# EasyEDA Pro project LR2-controller.eprj

# Schematic Schematic1
Board Name: Board1; Create Date: 2024-05-18; Page Name: P1; Project Name: LR2-controller; Schematic Name: Schematic1; Update Date: 2026-07-11; Company: EasyEDA.com; Drawn: EasyEDA; Page Size: A4; Part Number: JLCPCB-002; Reviewed: EasyEDA; Version: V0.1
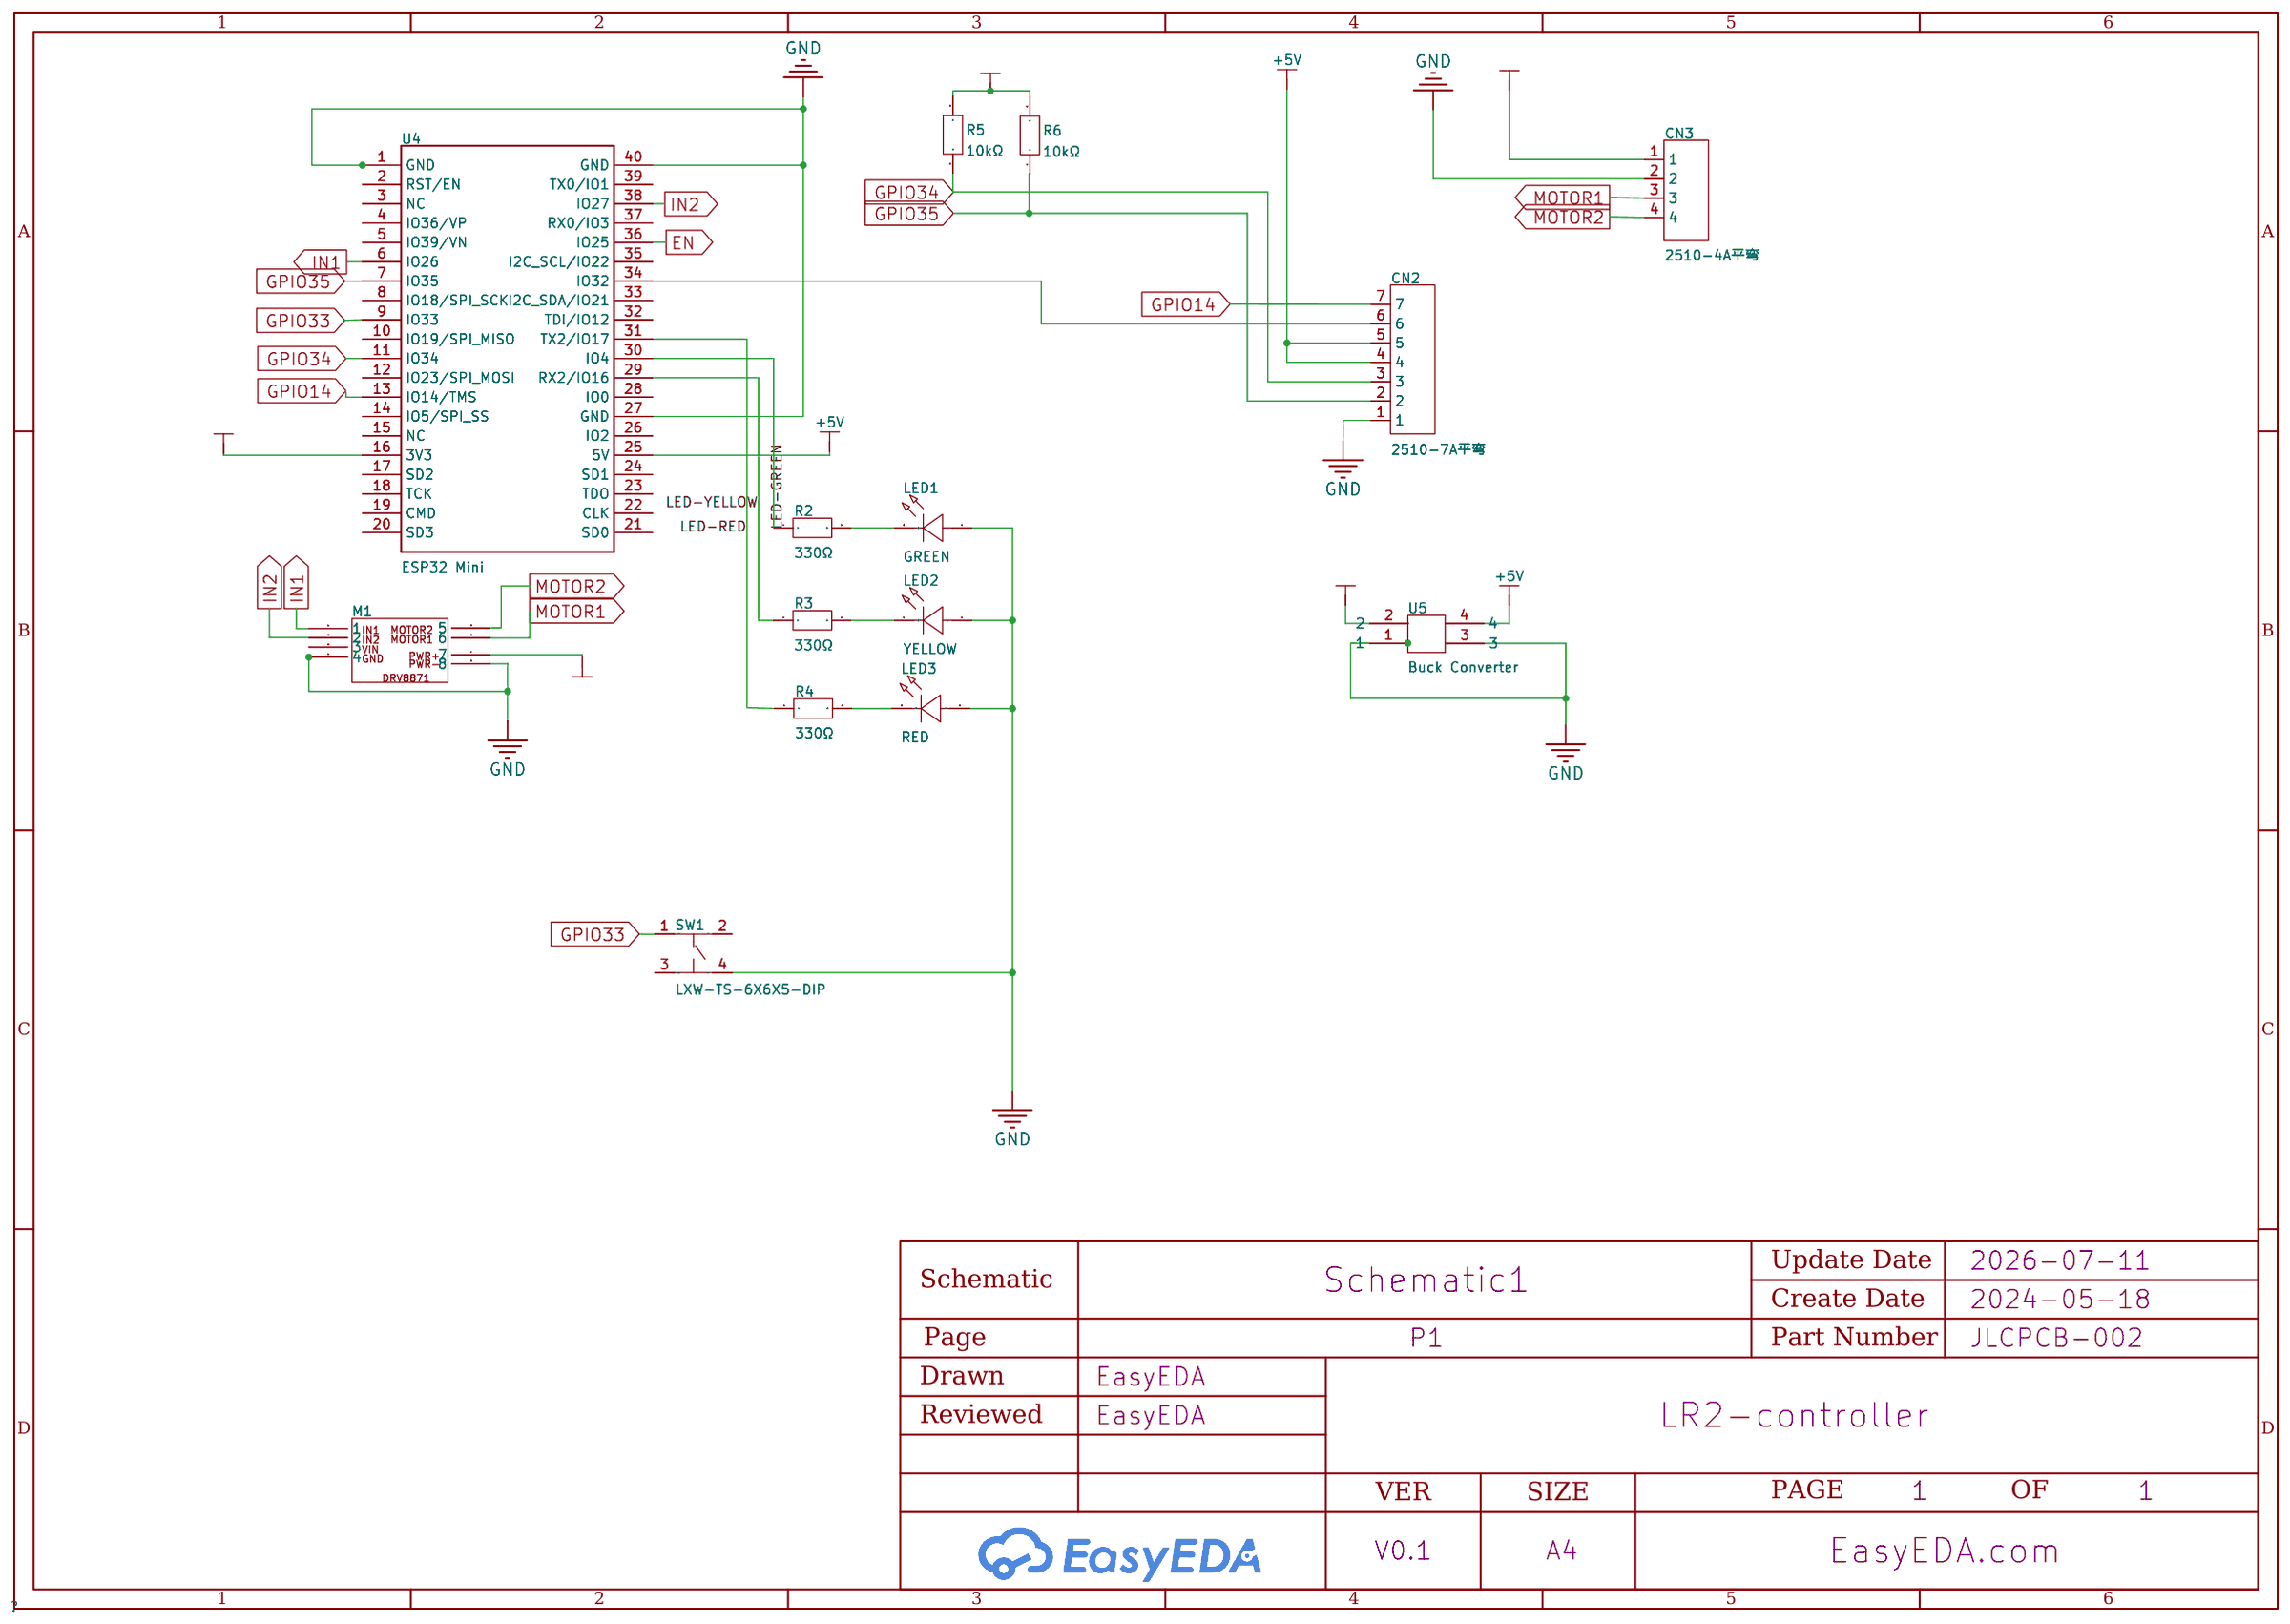
[diagram p0: schematic sheet]

## Parts
CN2  2510-7A平弯  [CONN-TH_7P-P2.54_KF2510-7AW]
CN3  2510-4A平弯  [CONN-TH_4P-P2.54_KF2510-4AGW]
LED1  GREEN  [LED-TH_BD5.8-P2.28-FD]
LED2  YELLOW  [LED-TH_BD5.8-P2.28-FD]
LED3  RED  [LED-TH_BD5.8-P2.28-FD]
M1  -  [Adafruit DRV8871]
R2  330Ω  [RES-TH_BD2.7-L6.2-P10.20-D0.4]
R3  330Ω  [RES-TH_BD2.7-L6.2-P10.20-D0.4]
R4  330Ω  [RES-TH_BD2.7-L6.2-P10.20-D0.4]
R5  10kΩ  [RES-TH_BD2.7-L6.2-P10.20-D0.4]
R6  10kΩ  [RES-TH_BD2.7-L6.2-P10.20-D0.4]
SW1  LXW-TS-6X6X5-DIP  [SW-TH_4P-L6.0-W6.0-P4.50-LS6.5]
U4  ESP32 Mini  [ESP32 TTGO MINI32]
U5  Buck Converter  [Buck Converter]

## Library data of the parts
CN2 = 2510-7A平弯: Pins Structure:1x7P Pitch:2.54mm Mounting Type:Right Angle Reference Series:KK 254(MX2510) Number of Pins:7P Number of Rows:1 Number of PINs Per Row:7 Row Spacing:- Current Rating:2.5A Contact Material:Phosphor Bronze Contact Plating:Tin Operating Tempera; LCSC Part Name: 1x7P 间距:2.54mm 弯插 系列:KK 254(MX2510); Supplier Part: C70896; Manufacturer: BOOMELE(博穆精密); Supplier Footprint: 弯插,P=2.54mm; JLCPCB Part Class: Extended Part; Datasheet: https://item.szlcsc.com/datasheet/2510-7A%25E5%25B9%25B3%25E5%25BC%25AF/71995.html; Supplier: LCSC; Pins Structure: 1x7P; Pitch: 2.54mm; Mounting Type: Right Angle; Reference Series: KK 254(MX2510); Number of Pins: 7P; Number of Rows: 1; Number of PINs Per Row: 7; Current Rating: 2.5A; Contact Material: Phosphor Bronze; Contact Plating: Tin; Operating Temperature: -25℃~+85℃; Voltage Rating: 250V; Color: White; Z-Height of the Board: 5.7mm; Y-Width of Bottom Edge on Board: 3.2mm
CN3 = 2510-4A平弯: LCSC Part Name: 1x4P 间距:2.54mm 弯插 系列:KK 254(MX2510); Supplier Part: C31753; Manufacturer: BOOMELE(博穆精密); Supplier Footprint: 弯插,P=2.54mm; JLCPCB Part Class: Extended Part; Datasheet: https://item.szlcsc.com/datasheet/2510-4A%25E5%25B9%25B3%25E5%25BC%25AF/32712.html; Supplier: LCSC; Pins Structure: 1x4P; Pitch: 2.54mm; Mounting Type: Right Angle; Reference Series: KK 254(MX2510); Number of Pins: 4P; Number of Rows: 1; Number of PINs Per Row: 4; Current Rating: 2.5A; Contact Material: Phosphor Bronze; Contact Plating: Tin; Operating Temperature: -25℃~+85℃; Voltage Rating: 250V; Color: White; Z-Height of the Board: 5.7mm; Y-Width of Bottom Edge on Board: 3.2mm
LED1-LED3 = 5A2K-10: LCSC Part Name: 5mm黑色红外光敏接收管; Supplier Part: C52034730; Manufacturer: Guiguang light(桂光光电); Supplier Footprint: 插件,D=5mm; JLCPCB Part Class: Extended Part; Datasheet: https://item.szlcsc.com/datasheet/5A2K-10/54791048.html; Supplier: LCSC; Voltage - DC Reverse(Vr): 30V; Peak Wavelength: 940nm; Spectral Range: 760nm~1100nm; Dark Current: 100nA; Operating Temperature: -40℃~+85℃
M1 = Adafruit DRV8871: Adafruit DRV8871 DC Motor Driver Breakout Board - 3.6A Max
R2-R4 = CR1/4W-330Ω±5%-OT52: LCSC Part Name: 碳膜电阻 330Ω ±5% 250mW 0.4镀锡铜脚 编带内跨距52MM; Supplier Part: C2894590; Manufacturer: VO(翔胜); Supplier Footprint: 插件,D2.7xL6.2mm; JLCPCB Part Class: Extended Part; Datasheet: https://item.szlcsc.com/datasheet/CR1%252F4W-330%25CE%25A9%25C2%25B15%2525-OT52/3130107.html; Supplier: LCSC; Type: Carbon Film Resistor; Tolerance: ±5%; Voltage-Supply(Max): 250V; Power(Watts): 250mW; Temperature Coefficient: ±350ppm/℃; Operating Temperature: -55℃~+155℃
R5 R6 = CR1/4W-10K±5%-OT52: Type:Carbon Resister Resistance: Tolerance:±5% Tolerance:±5% Voltage-Supply(Max):250V Power(Watts):250mW Temperature Coefficient:±350ppm/℃ Temperature Coefficient:±350ppm/℃ Operating Temperature:-55℃~+155℃ Operating Temperature:-55℃~+155℃; LCSC Part Name: 碳膜电阻 10kΩ ±5% 250mW 0.4镀锡铜脚 编带内跨距52MM; Supplier Part: C2894557; Manufacturer: VO(翔胜); Supplier Footprint: 插件,D2.7xL6.2mm; JLCPCB Part Class: Extended Part; Datasheet: https://atta.szlcsc.com/upload/public/pdf/source/20210803/C2857407_45FF53FE186CAB545115AD37303966CD.pdf; Supplier: LCSC; Type: Carbon Resister; Tolerance: ±5%; Voltage-Supply(Max): 250V; Power(Watts): 250mW; Temperature Coefficient: ±350ppm/℃; Operating Temperature: -55℃~+155℃
SW1 = LXW-TS-6X6X5-DIP: LCSC Part Name: 6*6*5mm 直插 轻触开关; Supplier Part: C53447028; Manufacturer: LXWCONN(连兴旺电子); Supplier Footprint: 插件-4P,6x6mm; JLCPCB Part Class: Extended Part; Datasheet: https://item.szlcsc.com/datasheet/LXW-TS-6X6X5-DIP/56599287.html; Supplier: LCSC
U4 = ESP32 Mini
U5 = Buck Converter

## Nets
+3.3V: R5.2 R6.2 U4.16(3V3)
+5V: CN2.4 CN2.5 U4.25(5V) U5.4
+12V: CN3.1 M1.7 U5.2
GND: CN2.1 CN3.2 LED1.1(A) LED2.1(A) LED3.1(A) M1.4 M1.8 SW1.4 U4.1(GND) U4.27(GND) U4.40(GND) U5.1 U5.3
GPIO14: CN2.7 U4.13(IO14/TMS)
GPIO33: SW1.1 U4.9(IO33)
GPIO34: CN2.3 R5.1
GPIO35: CN2.2 R6.1
IN1: M1.1 U4.6(IO26)
IN2: M1.2 U4.38(IO27)
LED-GREEN: R2.1 U4.30(IO4)
LED-RED: R4.1 U4.31(TX2/IO17)
LED-YELLOW: U4.29(RX2/IO16)
MOTOR1: CN3.3 M1.6
MOTOR2: CN3.4 M1.5
$1N1818: LED1.2(C) R2.2
$1N1822: LED2.2(C) R3.2
$1N1837: LED3.2(C) R4.2
$1N1926: CN2.6 U4.34(IO32)

Not connected (* = marked no-connect by the designer): M1 3; R3 1; SW1 2 3; U4 2(RST/EN) 3(NC) 4(IO36/VP) 5(IO39/VN) 7(IO35) 8(IO18/SPI SCK) 10(IO19/SPI MISO) 11(IO34) 12(IO23/SPI MOSI) 14(IO5/SPI SS) 15(NC) 17(SD2) 18(TCK) 19(CMD) 20(SD3) 21(SD0) 22(CLK) 23(TDO) 24(SD1) 26(IO2) 28(IO0) 32(TDI/IO12) 33(I2C SDA/IO21) 35(I2C SCL/IO22) 36(IO25) 37(RX0/IO3) 39(TX0/IO1)

# Schematic Schematicv2
Board Name: Boardv2; Create Date: 2026-08-23; Page Name: P1; Project Name: LR2-controller; Schematic Name: Schematicv2; Update Date: 2026-08-23; Company: EasyEDA.com; Drawn: EasyEDA; Page Size: A4; Part Number: JLCPCB-002; Reviewed: EasyEDA; Version: V0.1
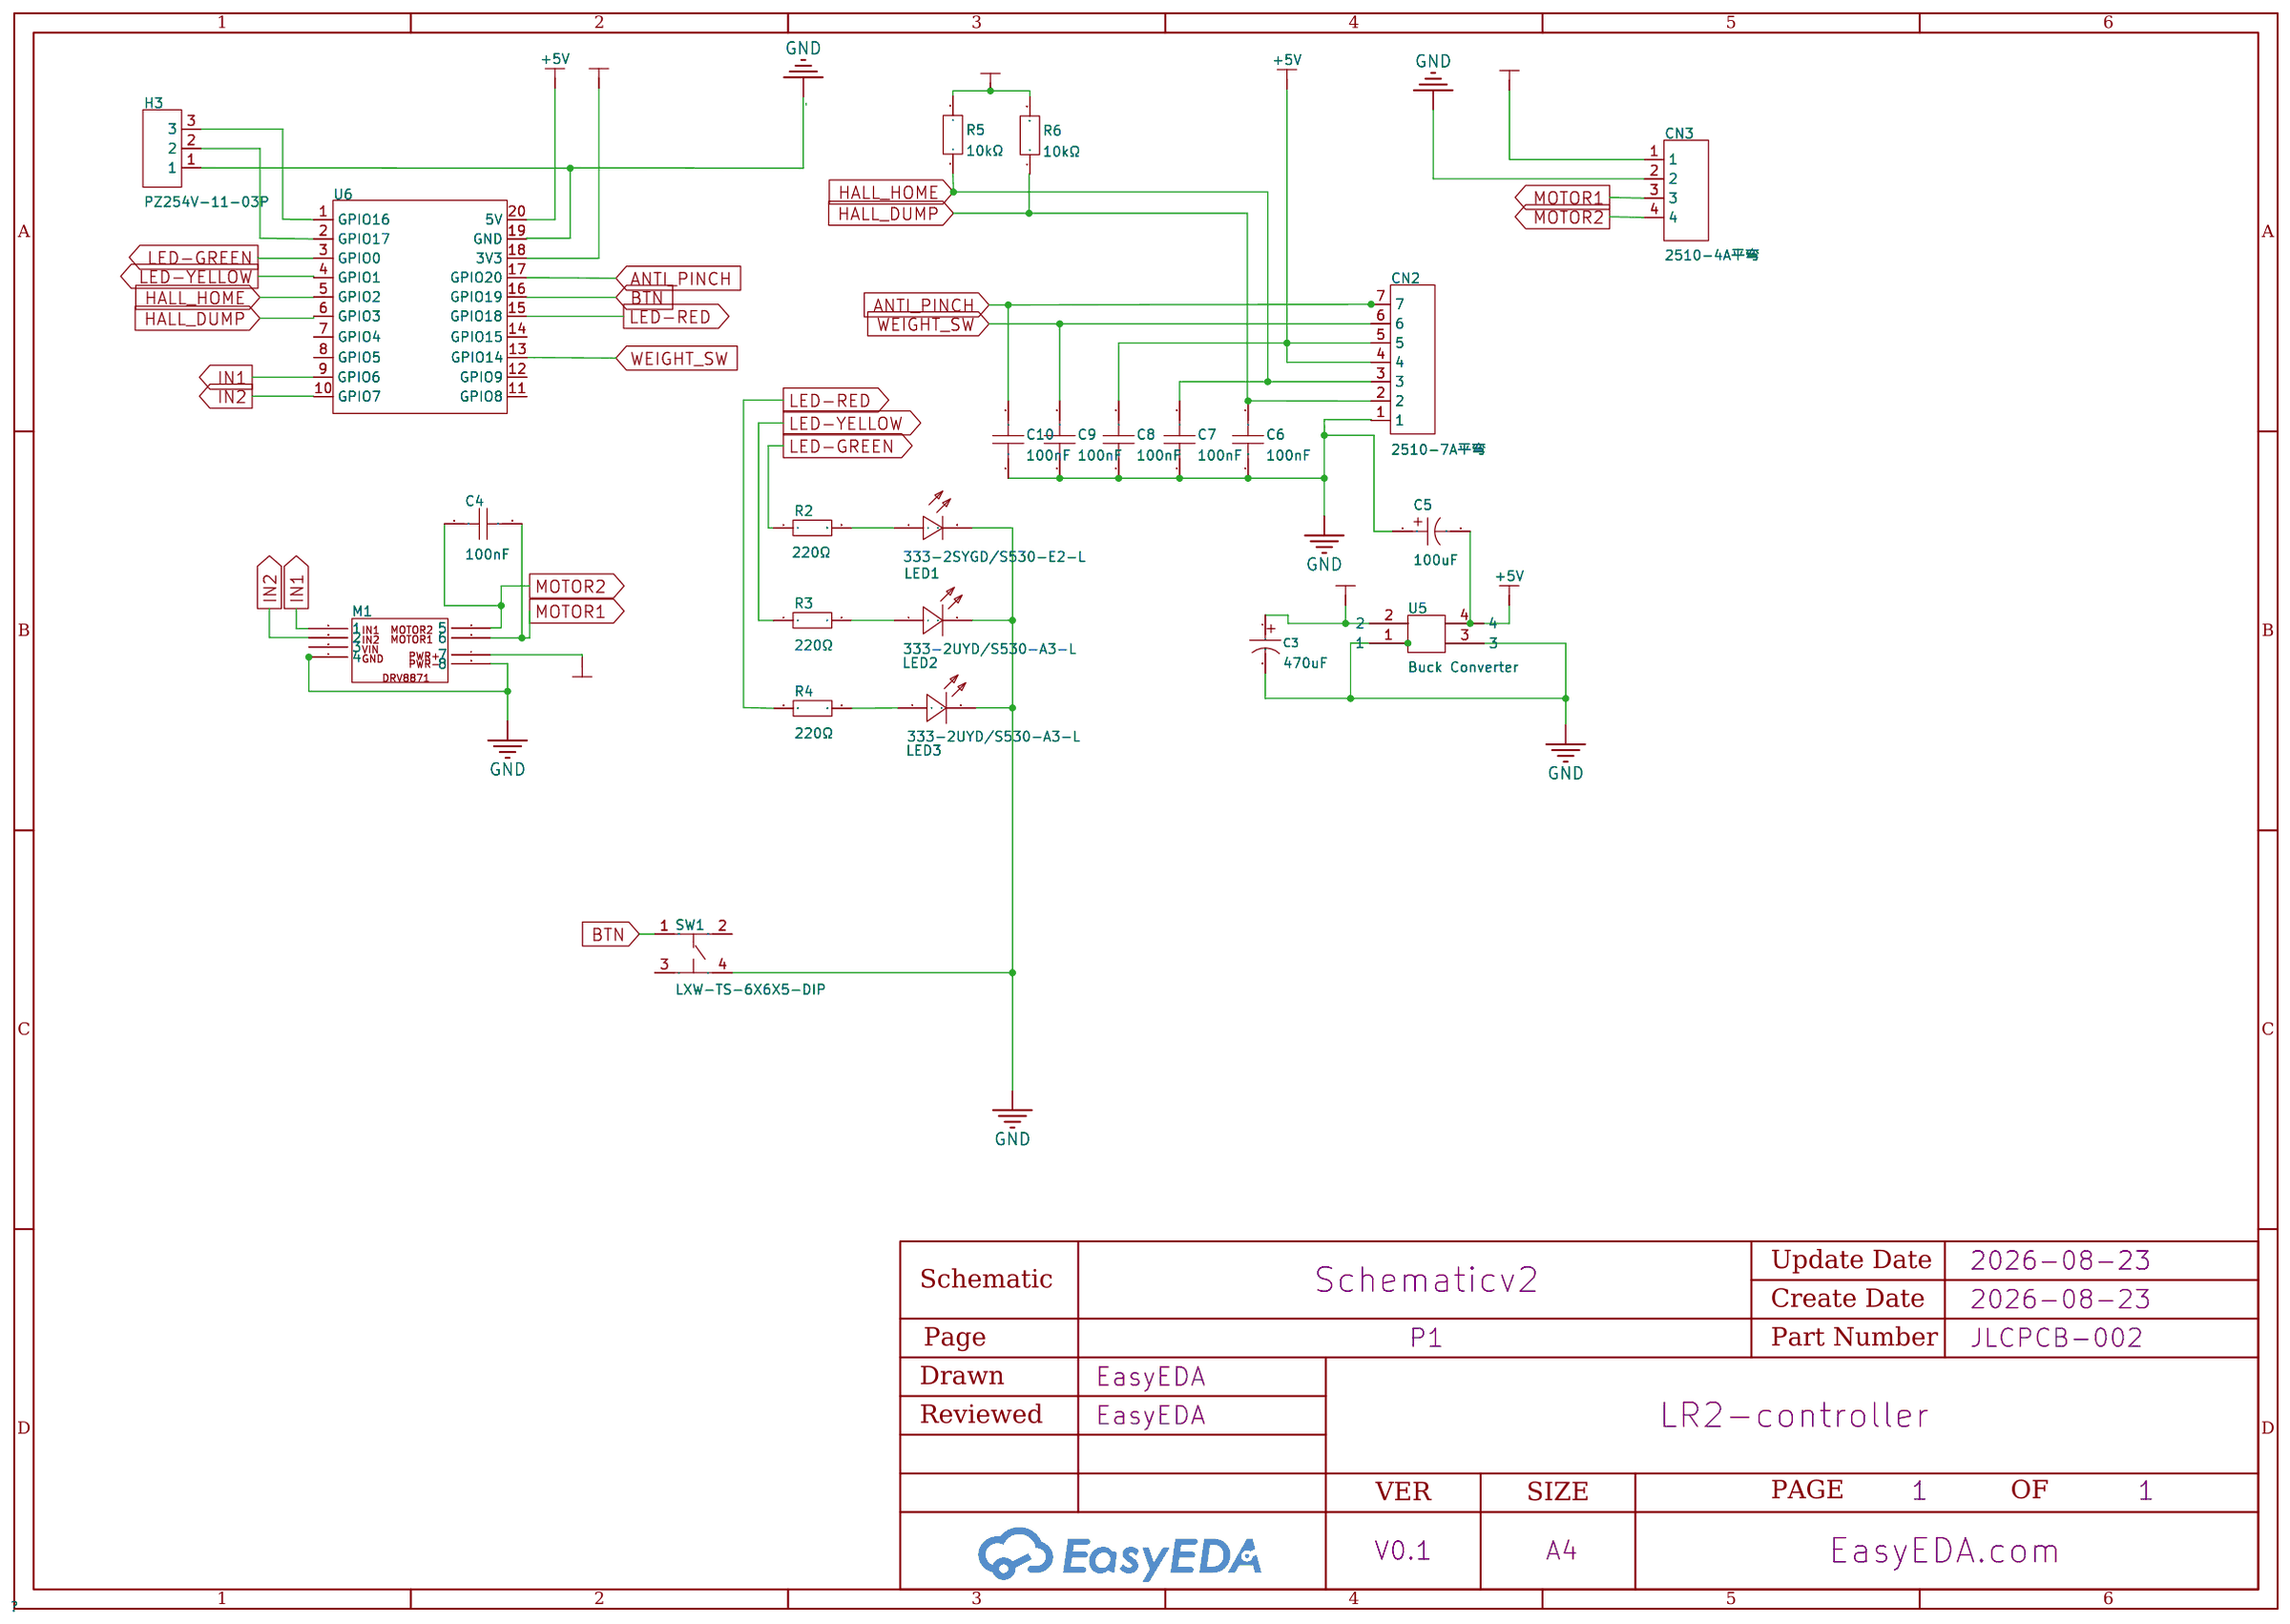
[diagram p1: schematic sheet]

## Parts
C3  470uF  [CAP-TH_BD10.0-P5.00-D1.0-FD]
C4  100nF  [CAP-TH_L4.5-W3.5-P5.08-D0.5]
C5  100uF  [CAP-TH_BD5.0-P2.00-D0.5-FD-1]
C6  100nF  [CAP-TH_L4.5-W3.5-P5.08-D0.5]
C7  100nF  [CAP-TH_L4.5-W3.5-P5.08-D0.5]
C8  100nF  [CAP-TH_L4.5-W3.5-P5.08-D0.5]
C9  100nF  [CAP-TH_L4.5-W3.5-P5.08-D0.5]
C10  100nF  [CAP-TH_L4.5-W3.5-P5.08-D0.5]
CN2  2510-7A平弯  [CONN-TH_7P-P2.54_KF2510-7AW]
CN3  2510-4A平弯  [CONN-TH_4P-P2.54_KF2510-4AGW]
H3  PZ254V-11-03P  [HDR-TH_3P-P2.54-V-M_PZ254V-11-03P]
LED1  333-2SYGD/S530-E2-L  [LED-TH_BD5.0-P2.54-FD]
LED2  333-2UYD/S530-A3-L  [LED-TH_BD5.0-P2.54-FD]
LED3  333-2UYD/S530-A3-L  [LED-TH_BD5.0-P2.54-FD]
M1  -  [Adafruit DRV8871]
R2  220Ω  [RES-TH_BD2.3-L6.5-P10.50-D0.5]
R3  220Ω  [RES-TH_BD2.3-L6.5-P10.50-D0.5]
R4  220Ω  [RES-TH_BD2.3-L6.5-P10.50-D0.5]
R5  10kΩ  [RES-TH_BD2.7-L6.2-P10.20-D0.4]
R6  10kΩ  [RES-TH_BD2.7-L6.2-P10.20-D0.4]
SW1  LXW-TS-6X6X5-DIP  [SW-TH_4P-L6.0-W6.0-P4.50-LS6.5]
U5  Buck Converter  [Buck Converter]
U6  ESP32-C6 SuperMini  [COMM-TH_ESP32-C6-SUPERMINI]

## Library data of the parts
C3 = 25WXA470MEFC10X9: LCSC Part Name: 470uF ±20% 25V; Supplier Part: C338182; Manufacturer: Rubycon(红宝石); Supplier Footprint: 插件,D10xL9mm; JLCPCB Part Class: Extended Part; Datasheet: https://item.szlcsc.com/datasheet/25WXA470MEFC10X9/315979.html; Supplier: LCSC; Tolerance: ±20%; Voltage Rating: 25V; Ripple Current: 370mA@120Hz; Pin Spacing: 5mm; Diameter: 10mm; Height - Seated (Max): 9mm; Lifetime: 2000hrs@105℃; Operating Temperature: -25℃~+125℃
C4 C6-C10 = CT4-0805-2X1-50V-0.1uF-K-Y: LCSC Part Name: 100nF ±10% 50V; Supplier Part: C41361550; Manufacturer: TORCH(火炬); Supplier Footprint: 插件,P=5.08mm; Datasheet: https://item.szlcsc.com/datasheet/CT4-0805-2X1-50V-0.1uF-K-Y/43105893.html; Supplier: LCSC; Tolerance: ±10%; Voltage Rating: 50V; Pin Spacing: 5.08mm
C5 = 16V100uF CD288: LCSC Part Name: 100uF ±20% 16V; Supplier Part: C2960195; Manufacturer: HRK(鸿瑞凯电子); Supplier Footprint: 插件,D5xL7mm; JLCPCB Part Class: Extended Part; Supplier: LCSC; Tolerance: ±20%; Voltage Rating: 16V; Pin Spacing: 2mm; Diameter: 5mm; Height - Seated (Max): 7mm; Operating Temperature: -40℃~+105℃
CN2 = 2510-7A平弯: Pins Structure:1x7P Pitch:2.54mm Mounting Type:Right Angle Reference Series:KK 254(MX2510) Number of Pins:7P Number of Rows:1 Number of PINs Per Row:7 Row Spacing:- Current Rating:2.5A Contact Material:Phosphor Bronze Contact Plating:Tin Operating Tempera; LCSC Part Name: 1x7P 间距:2.54mm 弯插 系列:KK 254(MX2510); Supplier Part: C70896; Manufacturer: BOOMELE(博穆精密); Supplier Footprint: 弯插,P=2.54mm; JLCPCB Part Class: Extended Part; Datasheet: https://item.szlcsc.com/datasheet/2510-7A%25E5%25B9%25B3%25E5%25BC%25AF/71995.html; Supplier: LCSC; Pins Structure: 1x7P; Pitch: 2.54mm; Mounting Type: Right Angle; Reference Series: KK 254(MX2510); Number of Pins: 7P; Number of Rows: 1; Number of PINs Per Row: 7; Current Rating: 2.5A; Contact Material: Phosphor Bronze; Contact Plating: Tin; Operating Temperature: -25℃~+85℃; Voltage Rating: 250V; Color: White; Z-Height of the Board: 5.7mm; Y-Width of Bottom Edge on Board: 3.2mm
CN3 = 2510-4A平弯: LCSC Part Name: 1x4P 间距:2.54mm 弯插 系列:KK 254(MX2510); Supplier Part: C31753; Manufacturer: BOOMELE(博穆精密); Supplier Footprint: 弯插,P=2.54mm; JLCPCB Part Class: Extended Part; Datasheet: https://item.szlcsc.com/datasheet/2510-4A%25E5%25B9%25B3%25E5%25BC%25AF/32712.html; Supplier: LCSC; Pins Structure: 1x4P; Pitch: 2.54mm; Mounting Type: Right Angle; Reference Series: KK 254(MX2510); Number of Pins: 4P; Number of Rows: 1; Number of PINs Per Row: 4; Current Rating: 2.5A; Contact Material: Phosphor Bronze; Contact Plating: Tin; Operating Temperature: -25℃~+85℃; Voltage Rating: 250V; Color: White; Z-Height of the Board: 5.7mm; Y-Width of Bottom Edge on Board: 3.2mm
H3 = PZ254V-11-03P: Pin Structure:1x3P Pitch:2.54mm Row Spacing:- Circluar Pins/Square Pins:Pin Header Mounting Type:Through Hole Number of Rows:1 Number of Pins:3P Current Rating:3A Voltage Rating (Max):250V Length of Mating Pin:6mm Insulation Height:2.5mm Length of End Con; LCSC Part Name: 1x3P 间距:2.54mm 方针 直插; Supplier Part: C2937625; Manufacturer: XFCN(兴飞); Supplier Footprint: 插件,P=2.54mm; JLCPCB Part Class: Extended Part; Datasheet: https://item.szlcsc.com/datasheet/PZ254V-11-03P/3293280.html; Supplier: LCSC; Pin Structure: 1x3P; Pitch: 2.54mm; Circluar Pins/Square Pins: Pin Header; Mounting Type: Through Hole; Number of Rows: 1; Number of Pins: 3P; Current Rating: 3A; Voltage Rating (Max): 250V; Length of Mating Pin: 6mm; Insulation Height: 2.5mm; Length of End Connection Pin: 3mm; Operating Temperature: -40℃~+105℃; Color: Black
LED1 = 333-2SYGD/S530-E2-L: LCSC Part Name: 普绿/黄绿; Supplier Part: C99697; Manufacturer: EVERLIGHT(亿光); Supplier Footprint: 插件,D=5mm; JLCPCB Part Class: Extended Part; Supplier: LCSC; Lamp Holder Type: 5mm round lamp head; Illumination Color: Yellow Green; Voltage - Forward(Vf): 2V; Power(Watts): 60mW; Forward Current: 20mA; Wavelength - Dominant: 573nm; Peak Wavelength: 575nm; Diode Configuration: Discrete Diode; Lens Color: Green Diffused Lens; Luminous Intensity: 80mcd; Viewing Angle: 45°; Operating Temperature: -40℃~+85℃
LED2 LED3 = 333-2UYD/S530-A3-L: LCSC Part Name: 黄灯; Supplier Part: C88602; Manufacturer: EVERLIGHT(亿光); Supplier Footprint: 插件,D=5mm; JLCPCB Part Class: Extended Part; Supplier: LCSC; Lamp Holder Type: 5mm round lamp head; Illumination Color: Yellow; Voltage - Forward(Vf): 2V~2.4V; Wavelength - Dominant: 589nm; Peak Wavelength: 591nm; Diode Configuration: Discrete Diode; Lens Color: Frosted Yellow Lens; Luminous Intensity: 160mcd~320mcd; Viewing Angle: 35°; Operating Temperature: -40℃~+85℃
M1 = Adafruit DRV8871: Adafruit DRV8871 DC Motor Driver Breakout Board - 3.6A Max
R2-R4 = CF1/4W-220Ω±5% T: Type:Carbon Resister Resistance: Tolerance:±5% Tolerance:±5% Voltage-Supply(Max):250V Power(Watts):250mW Temperature Coefficient:±350ppm/℃ Temperature Coefficient:±350ppm/℃ Operating Temperature:-55℃~+155℃ Operating Temperature:-55℃~+155℃; LCSC Part Name: 220Ω ±5% 250mW 碳膜电阻; Supplier Part: C120039; Manufacturer: CCO(千志电子); Supplier Footprint: 插件,D2.3xL6.5mm; JLCPCB Part Class: Extended Part; Datasheet: https://atta.szlcsc.com/upload/public/pdf/source/20190910/C427328_A0A2D65F3FD547937F4E674C90868175.pdf; Supplier: LCSC; Type: Carbon Resister; Tolerance: ±5%; Voltage-Supply(Max): 250V; Power(Watts): 250mW; Temperature Coefficient: ±350ppm/℃; Operating Temperature: -55℃~+155℃
R5 R6 = CR1/4W-10K±5%-OT52: Type:Carbon Resister Resistance: Tolerance:±5% Tolerance:±5% Voltage-Supply(Max):250V Power(Watts):250mW Temperature Coefficient:±350ppm/℃ Temperature Coefficient:±350ppm/℃ Operating Temperature:-55℃~+155℃ Operating Temperature:-55℃~+155℃; LCSC Part Name: 碳膜电阻 10kΩ ±5% 250mW 0.4镀锡铜脚 编带内跨距52MM; Supplier Part: C2894557; Manufacturer: VO(翔胜); Supplier Footprint: 插件,D2.7xL6.2mm; JLCPCB Part Class: Extended Part; Datasheet: https://atta.szlcsc.com/upload/public/pdf/source/20210803/C2857407_45FF53FE186CAB545115AD37303966CD.pdf; Supplier: LCSC; Type: Carbon Resister; Tolerance: ±5%; Voltage-Supply(Max): 250V; Power(Watts): 250mW; Temperature Coefficient: ±350ppm/℃; Operating Temperature: -55℃~+155℃
SW1 = LXW-TS-6X6X5-DIP: LCSC Part Name: 6*6*5mm 直插 轻触开关; Supplier Part: C53447028; Manufacturer: LXWCONN(连兴旺电子); Supplier Footprint: 插件-4P,6x6mm; JLCPCB Part Class: Extended Part; Datasheet: https://item.szlcsc.com/datasheet/LXW-TS-6X6X5-DIP/56599287.html; Supplier: LCSC
U5 = Buck Converter
U6 = ESP32-C6 SuperMini

## Nets
+3.3V: R5.2 R6.2 U6.18(3V3)
+5V: C5.2 C8.2 CN2.4 CN2.5 U5.4 U6.20(5V)
+12V: C3.1 CN3.1 M1.7 U5.2
GND: C3.2 C5.1 C6.1 C7.1 C8.1 C9.1 C10.1 CN2.1 CN3.2 H3.1 LED1.2(K) LED2.2(K) LED3.2(K) M1.4 M1.8 SW1.4 U5.1 U5.3 U6.19(GND)
ANTI_PINCH: C10.2 CN2.7 U6.17(GPIO20)
BTN: SW1.1
HALL_DUMP: C6.2 CN2.2 R6.1 U6.6(GPIO3)
HALL_HOME: C7.2 CN2.3 R5.1
IN1: M1.1 U6.9(GPIO6)
IN2: M1.2
LED-GREEN: R2.1 U6.3(GPIO0)
LED-RED: R4.1 U6.15(GPIO18)
LED-YELLOW: U6.4(GPIO1)
MOTOR1: C4.2 CN3.3 M1.6
MOTOR2: C4.1 CN3.4 M1.5
WEIGHT_SW: C9.2 U6.13(GPIO14)
$1N1818: LED1.1(A) R2.2
$1N1822: LED2.1(A) R3.2
$1N7655: H3.3 U6.1(GPIO16)
$1N7691: H3.2 U6.2(GPIO17)
$1N8896: LED3.1(A) R4.2

Not connected (* = marked no-connect by the designer): CN2 6; M1 3; R3 1; SW1 2 3; U6 5(GPIO2) 7(GPIO4) 8(GPIO5) 10(GPIO7) 11(GPIO8) 12(GPIO9) 14(GPIO15) 16(GPIO19)

# Board PCB1
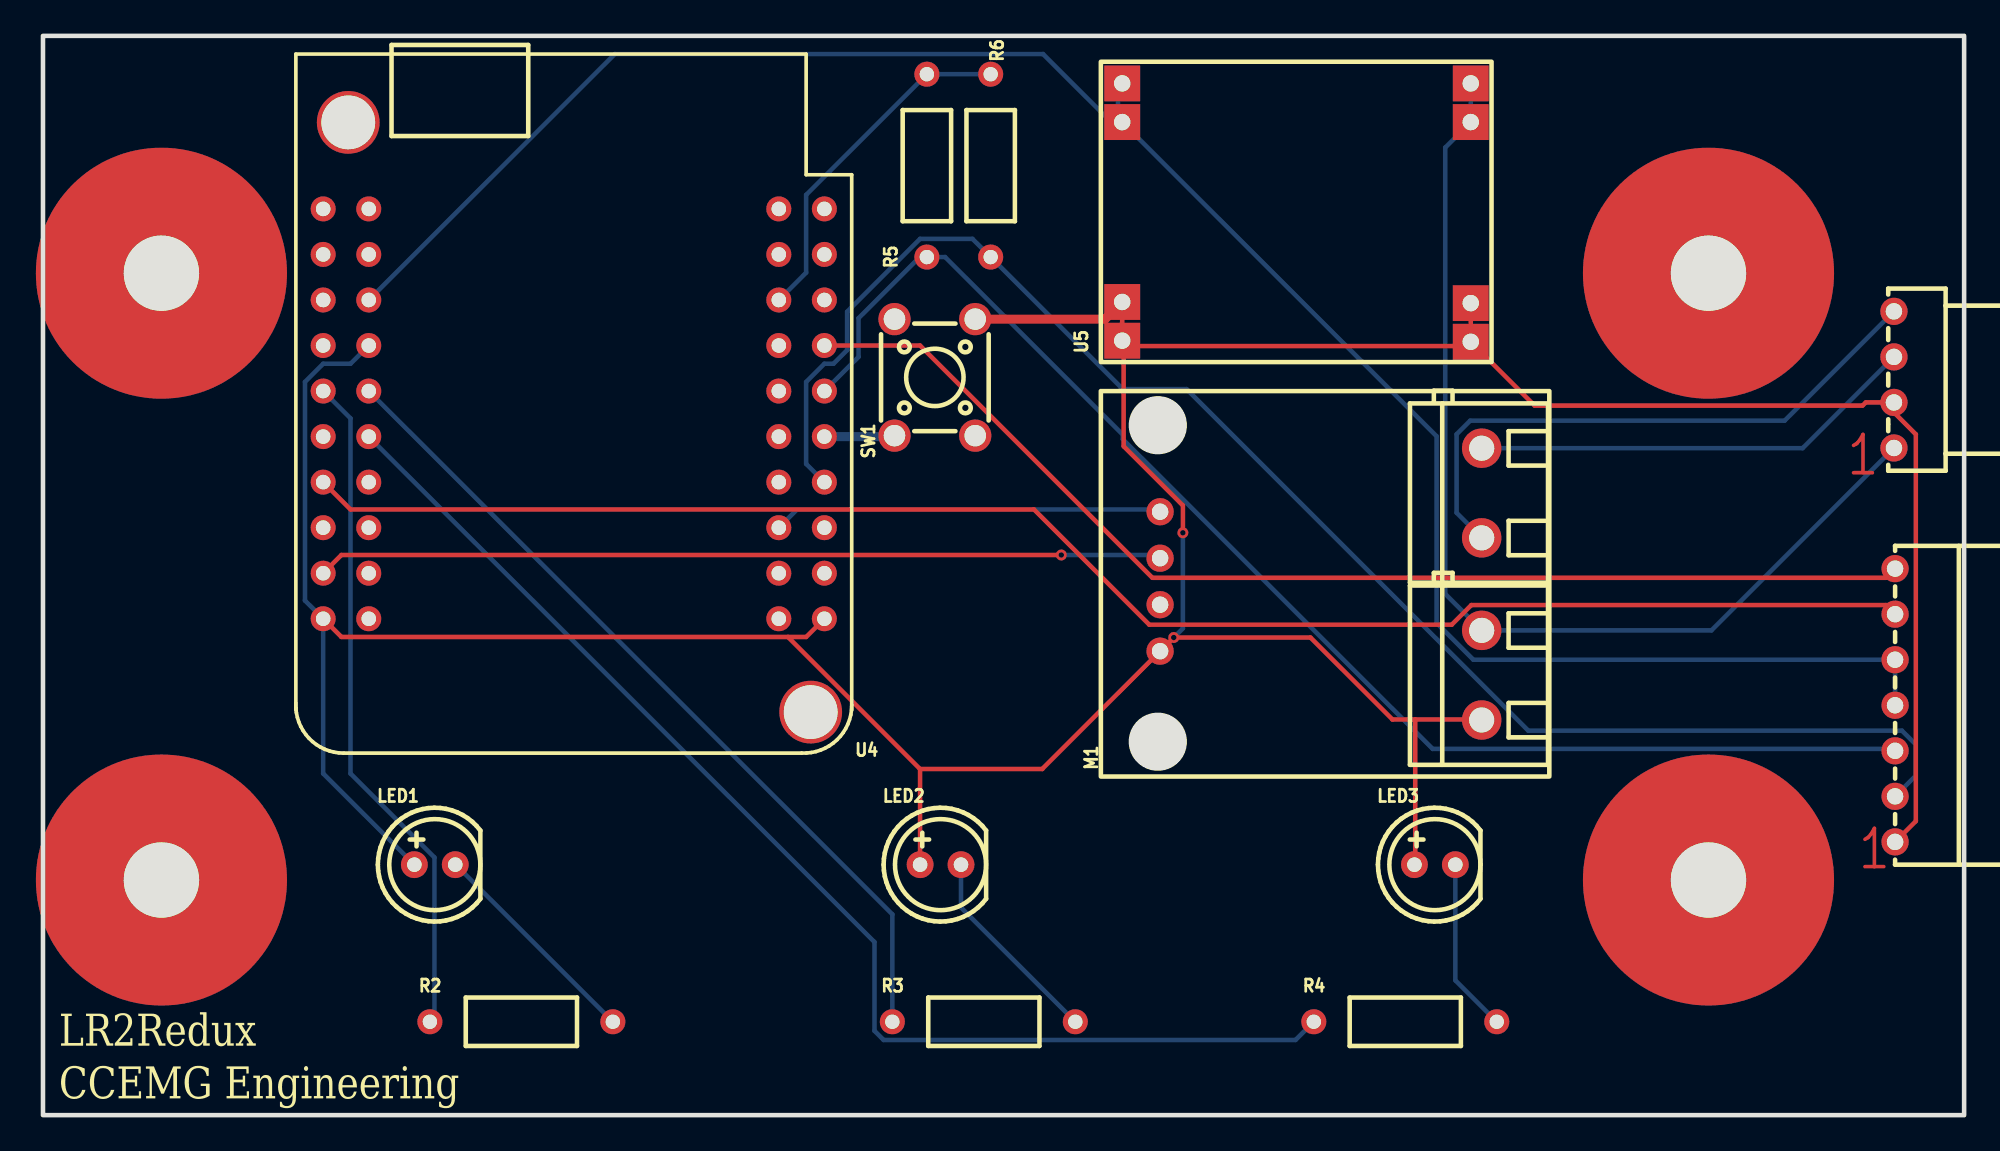
[diagram p2: board, top side]
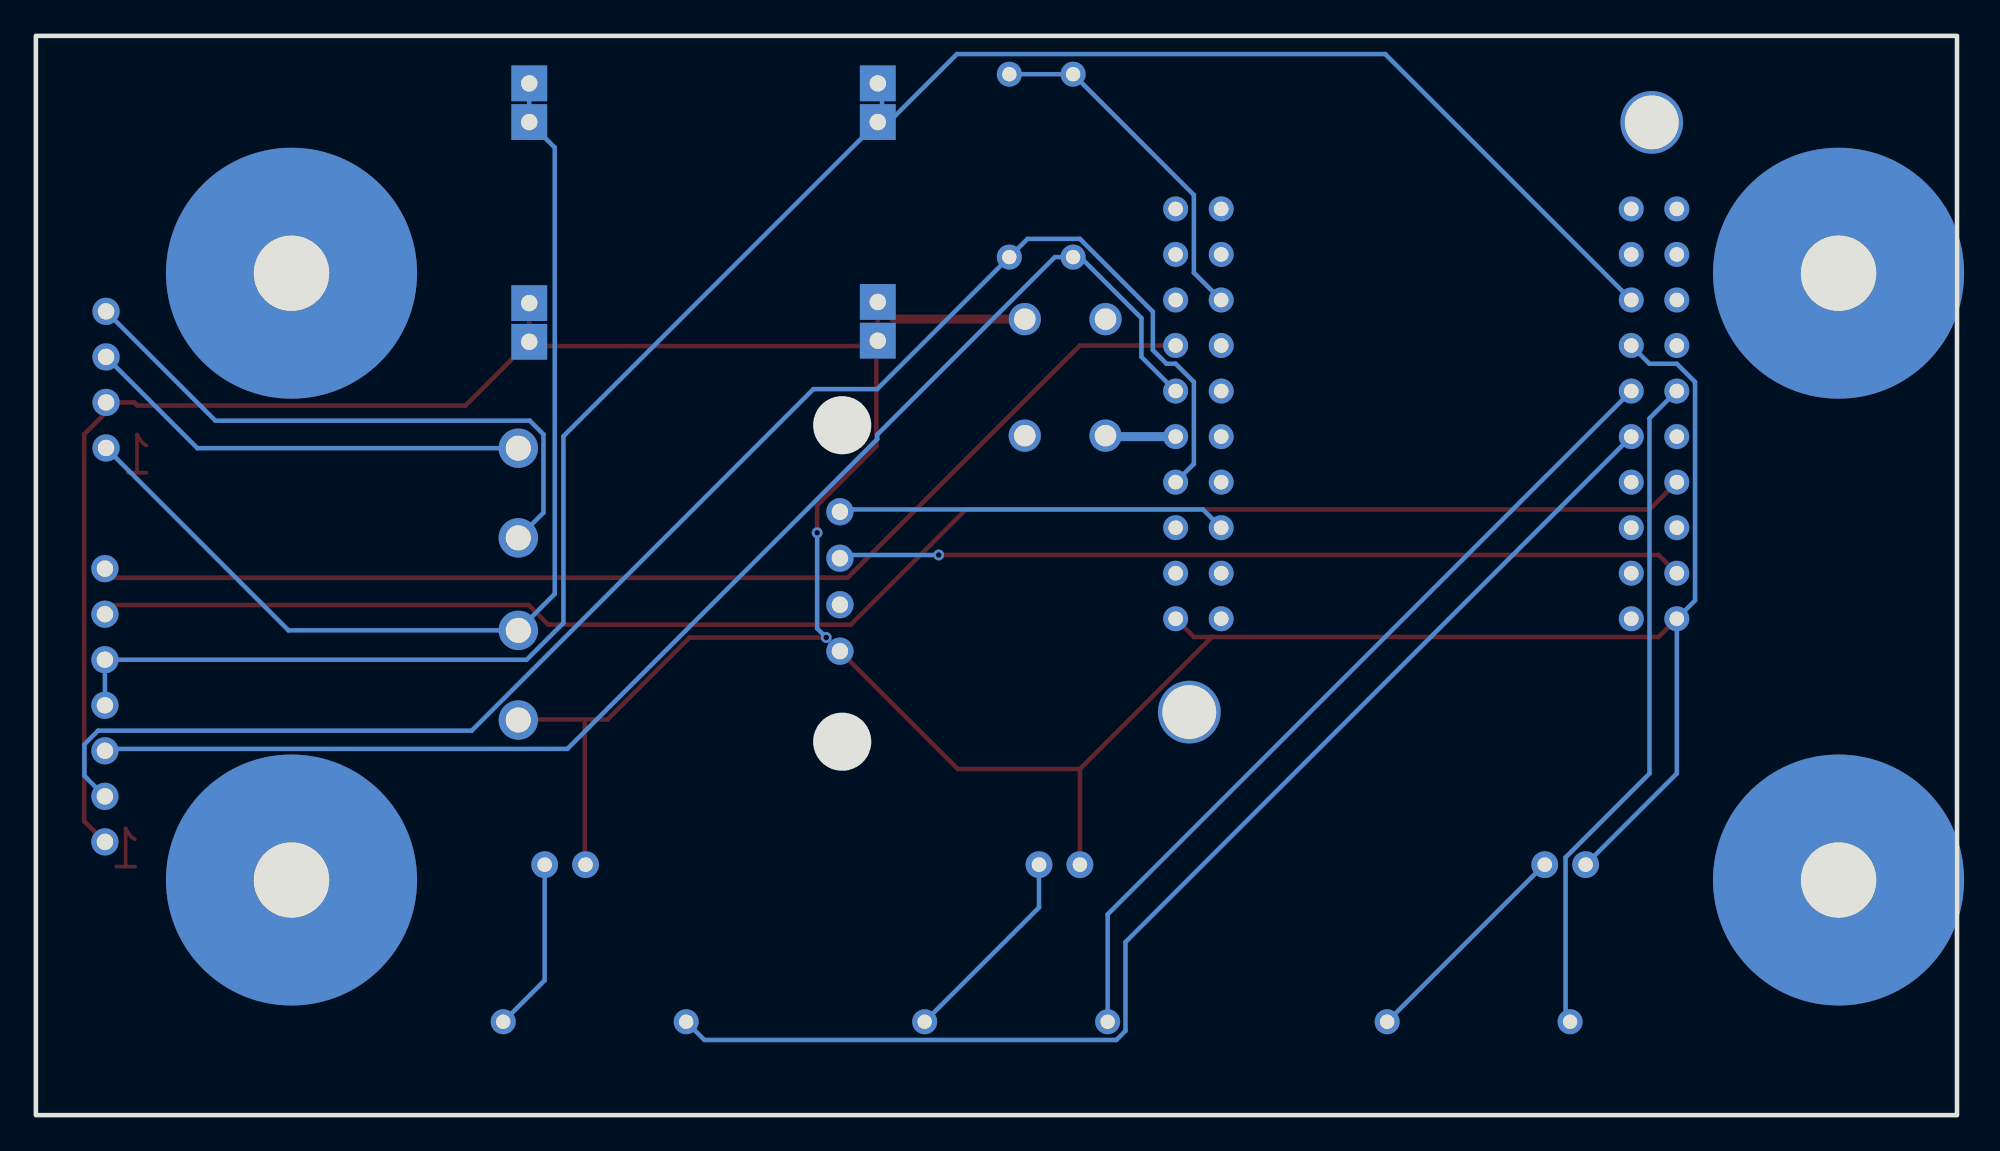
[diagram p3: board, bottom side, seen from below]

Outline 107.1 x 60.2 mm; copper layers: Top Layer, Bottom Layer. Coordinates in mm from the lower left corner of the outline.
Outline path: rectangle 0,60.2 107.1,0
Stack: Top Layer 0.035mm / Dielectric1 1.51mm FR4 er 4.5 / Bottom Layer 0.035mm

## Design rules (mm)
template: JLCPCB Capability(Two Layers Board)
spacing copperThickness1oz (default): track to track 0.102, other pairs 0.152 to 0.3
spacing copperThickness2oz: track to track 0.203, other pairs 0.152 to 0.3
track width copperThickness1oz (default): min 0.127, default 0.254, max 2.54
track width copperThickness2oz: min 0.203, default 0.254, max 2.54
differential pair differentialPair (default): width min 0.127, default 0.254, max 2.54; gap min 0.152, default 0.152
via viaSize (default): diameter min 0.5, default 0.61, max 10; hole min 0.3, default 0.305, max 6.3

## Placement (name value [footprint] x y rotation side)
CN2  2510-7A平弯  [CONN-TH_7P-P2.54_KF2510-7AW]  103.25 22.86 270 top
CN3  2510-4A平弯  [CONN-TH_4P-P2.54_KF2510-4AGW]  103.19 41.02 270 top
LED1  GREEN  [LED-TH_BD5.8-P2.28-FD]  21.84 13.97 0 top
LED2  YELLOW  [LED-TH_BD5.8-P2.28-FD]  50.04 13.97 0 top
LED3  RED  [LED-TH_BD5.8-P2.28-FD]  77.6 13.97 0 top
M1  -  [Adafruit DRV8871]  53.77 8.13 0 top
NOREF  -  [Pad_e3]  92.85 46.96 0 top
NOREF#2  -  [Pad_e6]  6.6 13.11 0 top
NOREF#3  -  [Pad_e5]  92.85 13.11 0 top
NOREF#4  -  [Pad_e7]  6.6 46.96 0 top
R2  330Ω  [RES-TH_BD2.7-L6.2-P10.20-D0.4]  26.67 5.21 0 top
R3  330Ω  [RES-TH_BD2.7-L6.2-P10.20-D0.4]  52.45 5.21 0 top
R4  330Ω  [RES-TH_BD2.7-L6.2-P10.20-D0.4]  75.95 5.21 0 top
R5  10kΩ  [RES-TH_BD2.7-L6.2-P10.20-D0.4]  49.28 52.96 90 top
R6  10kΩ  [RES-TH_BD2.7-L6.2-P10.20-D0.4]  52.83 52.96 90 top
SW1  LXW-TS-6X6X5-DIP  [SW-TH_4P-L6.0-W6.0-P4.50-LS6.5]  49.72 41.15 90 top
U4  ESP32 Mini  [ESP32 TTGO MINI32]  30.86 37.85 180 top
U5  -  [Buck Converter]  82.04 17.4 0 top

## Footprints (pads in the part's own frame, mm; a bottom-side part is the same pattern mirrored in y, then rotated)
Adafruit DRV8871
  round 1.524 hole 0.914: 1(8.509,25.527) 2(8.509,22.934) 3(8.509,20.341) 4(8.509,17.749)
  round 2.2 hole 1.4: 5(26.438,24.07) 6(26.438,29.07) 7(26.438,18.91) 8(26.438,13.91)
Buck Converter
  rect 2x2 hole 0.914: 1(-2.446,27.893) 1(-2.446,25.734) 2(-2.446,40.148) 2(-2.446,37.989) 3(-21.877,27.956) 3(-21.877,25.797) 4(-21.877,40.148) 4(-21.877,37.989)
CONN-TH_4P-P2.54_KF2510-4AGW
  round 1.524 hole 0.914: 1(3.81,0) 2(1.27,0) 3(-1.27,0) 4(-3.81,0)
CONN-TH_7P-P2.54_KF2510-7AW
  round 1.524 hole 0.914: 1(7.62,0) 2(5.08,0) 3(2.54,0) 4(0,0) 5(-2.54,0) 6(-5.08,0) 7(-7.62,0)
ESP32 TTGO MINI32
  round 3.5 hole 3: (-11.938,15.367) (13.843,-17.526)
  round 1.397 hole 0.813: 1(-12.7,10.16) 2(-10.16,10.16) 3(-12.7,7.62) 4(-10.16,7.62) 5(-12.7,5.08) 6(-10.16,5.08) 7(-12.7,2.54) 8(-10.16,2.54) 9(-12.7,0) 10(-10.16,0) 11(-12.7,-2.54) 12(-10.16,-2.54) 13(-12.7,-5.08) 14(-10.16,-5.08) 15(-12.7,-7.62) 16(-10.16,-7.62) 17(-12.7,-10.16) 18(-10.16,-10.16) 19(-12.7,-12.7) 20(-10.16,-12.7) 21(12.7,-12.7) 22(15.24,-12.7) 23(12.7,-10.16) 24(15.24,-10.16) 25(12.7,-7.62) 26(15.24,-7.62) 27(12.7,-5.08) 28(15.24,-5.08) 29(12.7,-2.54) 30(15.24,-2.54) 31(12.7,0) 32(15.24,0) 33(12.7,2.54) 34(15.24,2.54) 35(12.7,5.08) 36(15.24,5.08) 37(12.7,7.62) 38(15.24,7.62) 39(12.7,10.16) 40(15.24,10.16)
LED-TH_BD5.8-P2.28-FD
  round 1.5 hole 0.813: 1(-1.14,0) 2(1.14,0)
Pad_e3
  round 14 hole 4.2: 1(0,0)
Pad_e5
  round 14 hole 4.2: 1(0,0)
Pad_e6
  round 14 hole 4.2: 1(0,0)
Pad_e7
  round 14 hole 4.2: 1(0,0)
RES-TH_BD2.7-L6.2-P10.20-D0.4
  round 1.4 hole 0.8: 1(-5.1,0) 2(5.1,0)
SW-TH_4P-L6.0-W6.0-P4.50-LS6.5
  round 1.8 hole 1.2: 1(-3.25,2.25) 2(3.25,2.25) 3(-3.25,-2.25) 4(3.25,-2.25)

## Nets
As in the schematic, except:
GPIO34: CN2.3 R5.1 U4.11
GPIO35: CN2.2 R6.1 U4.7
LED-YELLOW: R3.1 U4.29

Pads without a net: M1 3; NOREF 1; NOREF#2 1; NOREF#3 1; NOREF#4 1; SW1 2 3; U4 2 3 4 5 8 10 12 14 15 17 18 19 20 21 22 23 24 26 28 32 33 35 37 39

## Via types
v1: diameter 0.61, hole 0.305, Top Layer to Bottom Layer, 3 vias

## Routing (per net, layer and track width the routed paths; a pad name or vN(x,y) marks a point on that pad's centre or on a via; arc(x,y) is an arc through that point)
+3.3V: length 19.6
  Bottom Layer w0.254: U4.16 42.54,46.99 42.54,51.33 R5.2 R6.2
+5V: length 115.4
  Bottom Layer w0.254: 59.93,55.63 59.31,55.63 55.75,59.18 31.88,59.18 18.16,45.47 ; 59.93,55.63 U5.4 77.69,37.86 77.69,27.45 79.74,25.4 CN2.5 CN2.4 ; 59.93,55.63 59.93,57.31 U5.4
+12V: length 59.1
  Bottom Layer w0.254: U5.2 U5.2 78.17,53.97 78.17,29.07 M1.7 93.02,27.04 CN3.1
GND: length 224.1
  Top Layer w0.254: 102.63,39.75 104.41,37.97 104.41,16.4 CN2.1 ; 102.63,39.75 CN3.2 ; 102.63,39.75 101.61,39.75 101.44,39.58 83.15,39.58 U5.1 ; U5.1 79.36,42.9 60.25,42.9 ; U5.1 U5.1 ; 48.9,19.31 55.7,19.31 v1(63.04,26.64) 70.66,26.64 75.23,22.07 76.5,22.07 ; 48.9,19.31 41.53,26.67 ; 48.9,19.31 48.9,13.97 ; 60.25,42.9 60.25,37.31 63.55,34.01 v1(63.55,32.48) ; 60.25,42.9 U5.3 U5.3 ; 76.5,22.07 80.18,22.07 M1.8 ; 76.5,22.07 76.5,14.02 LED3.1 ; U4.40 16.64,26.67 41.53,26.67 ; 41.53,26.67 42.54,26.67 43.56,27.69
  Top Layer w0.508: SW1.4 59.21,44.4 U5.3
  Bottom Layer w0.254: LED1.1 15.62,19.05 U4.40 14.61,28.7 14.61,40.9 15.62,41.91 17.14,41.91 18.16,42.93 ; v1(63.55,32.48) 63.55,27.15 v1(63.04,26.64)
GPIO14: length 65.3
  Top Layer w0.254: 43.56,42.93 48.9,42.93 61.85,29.97 102.74,29.97 CN2.7
GPIO33: length 3.9
  Bottom Layer w0.508: SW1.1 47.42,37.85 43.56,37.85
GPIO34: length 75.6
  Bottom Layer w0.254: CN2.3 103.14,20.43 77.47,20.43 60.2,37.7 60.2,37.95 50.29,47.86 R5.1 48.88,47.86 45.47,44.45 45.47,42.29 43.56,40.39
GPIO35: length 87.5
  Bottom Layer w0.254: CN2.2 104.39,18.92 104.39,20.68 103.63,21.44 82.8,21.44 63.75,40.49 60.2,40.49 R6.1 51.82,48.88 48.9,48.88 44.83,44.81 44.83,42.67 44.07,41.91 43.56,41.91 42.54,40.9 42.54,36.32 43.56,35.31
IN1: length 21.7
  Bottom Layer w0.254: M1.1 62.15,33.78 42.04,33.78 U4.6
IN2: length 47.2
  Top Layer w0.254: v1(56.77,31.24) 16.64,31.24 U4.38
  Bottom Layer w0.254: M1.2 62.1,31.24 v1(56.77,31.24)
LED-GREEN: length 37.9
  Bottom Layer w0.254: R2.1 21.82,5.46 21.82,14.37 17.14,19.05 17.14,38.86 U4.30
LED-RED: length 69.9
  Bottom Layer w0.254: R4.1 69.83,4.19 46.86,4.19 46.35,4.7 46.35,9.65 18.16,37.85
LED-YELLOW: length 47.3
  Bottom Layer w0.254: R3.1 47.35,11.2 18.16,40.39
MOTOR1: length 25.1
  Bottom Layer w0.254: CN3.3 98.1,37.2 M1.6
MOTOR2: length 33.6
  Bottom Layer w0.254: M1.5 78.8,33.6 78.8,37.97 79.57,38.74 97.09,38.74 CN3.4
$1N1818: length 12.4
  Bottom Layer w0.254: R2.2 23.01,13.97 LED1.2
$1N1822: length 11.4
  Bottom Layer w0.254: R3.2 51.18,11.58 LED2.2
$1N1837: length 9.7
  Bottom Layer w0.254: R4.2 78.74,7.52 LED3.2
$1N1926: length 91.6
  Top Layer w0.254: CN2.6 102.74,28.45 79.63,28.45 78.54,27.36 61.67,27.36 55.25,33.78 17.14,33.78 U4.34

## Text on the board
Top Layer: 1
Top Silkscreen Layer: LR2Redux / CCEMG Engineering

# Board PCBv2
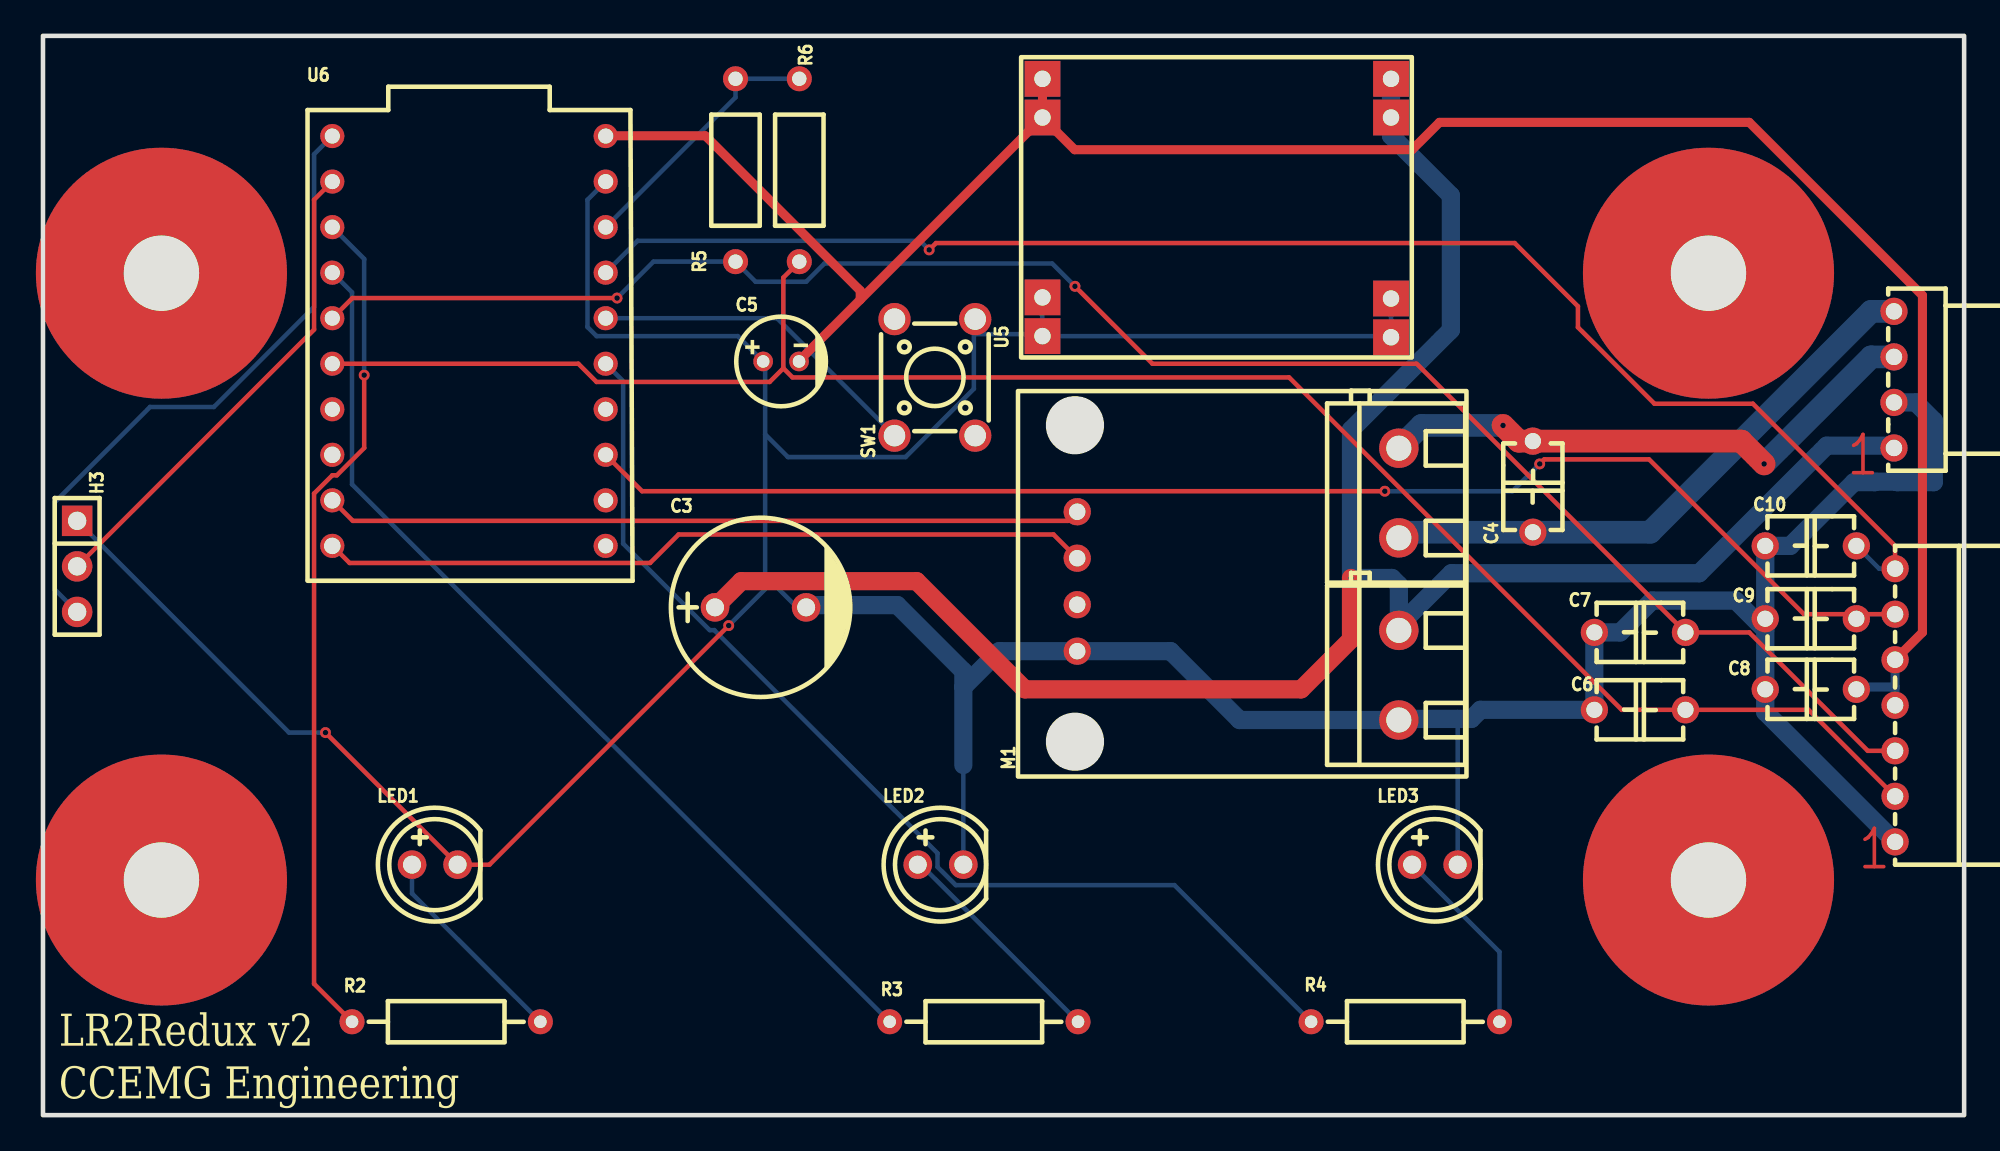
[diagram p4: board, top side]
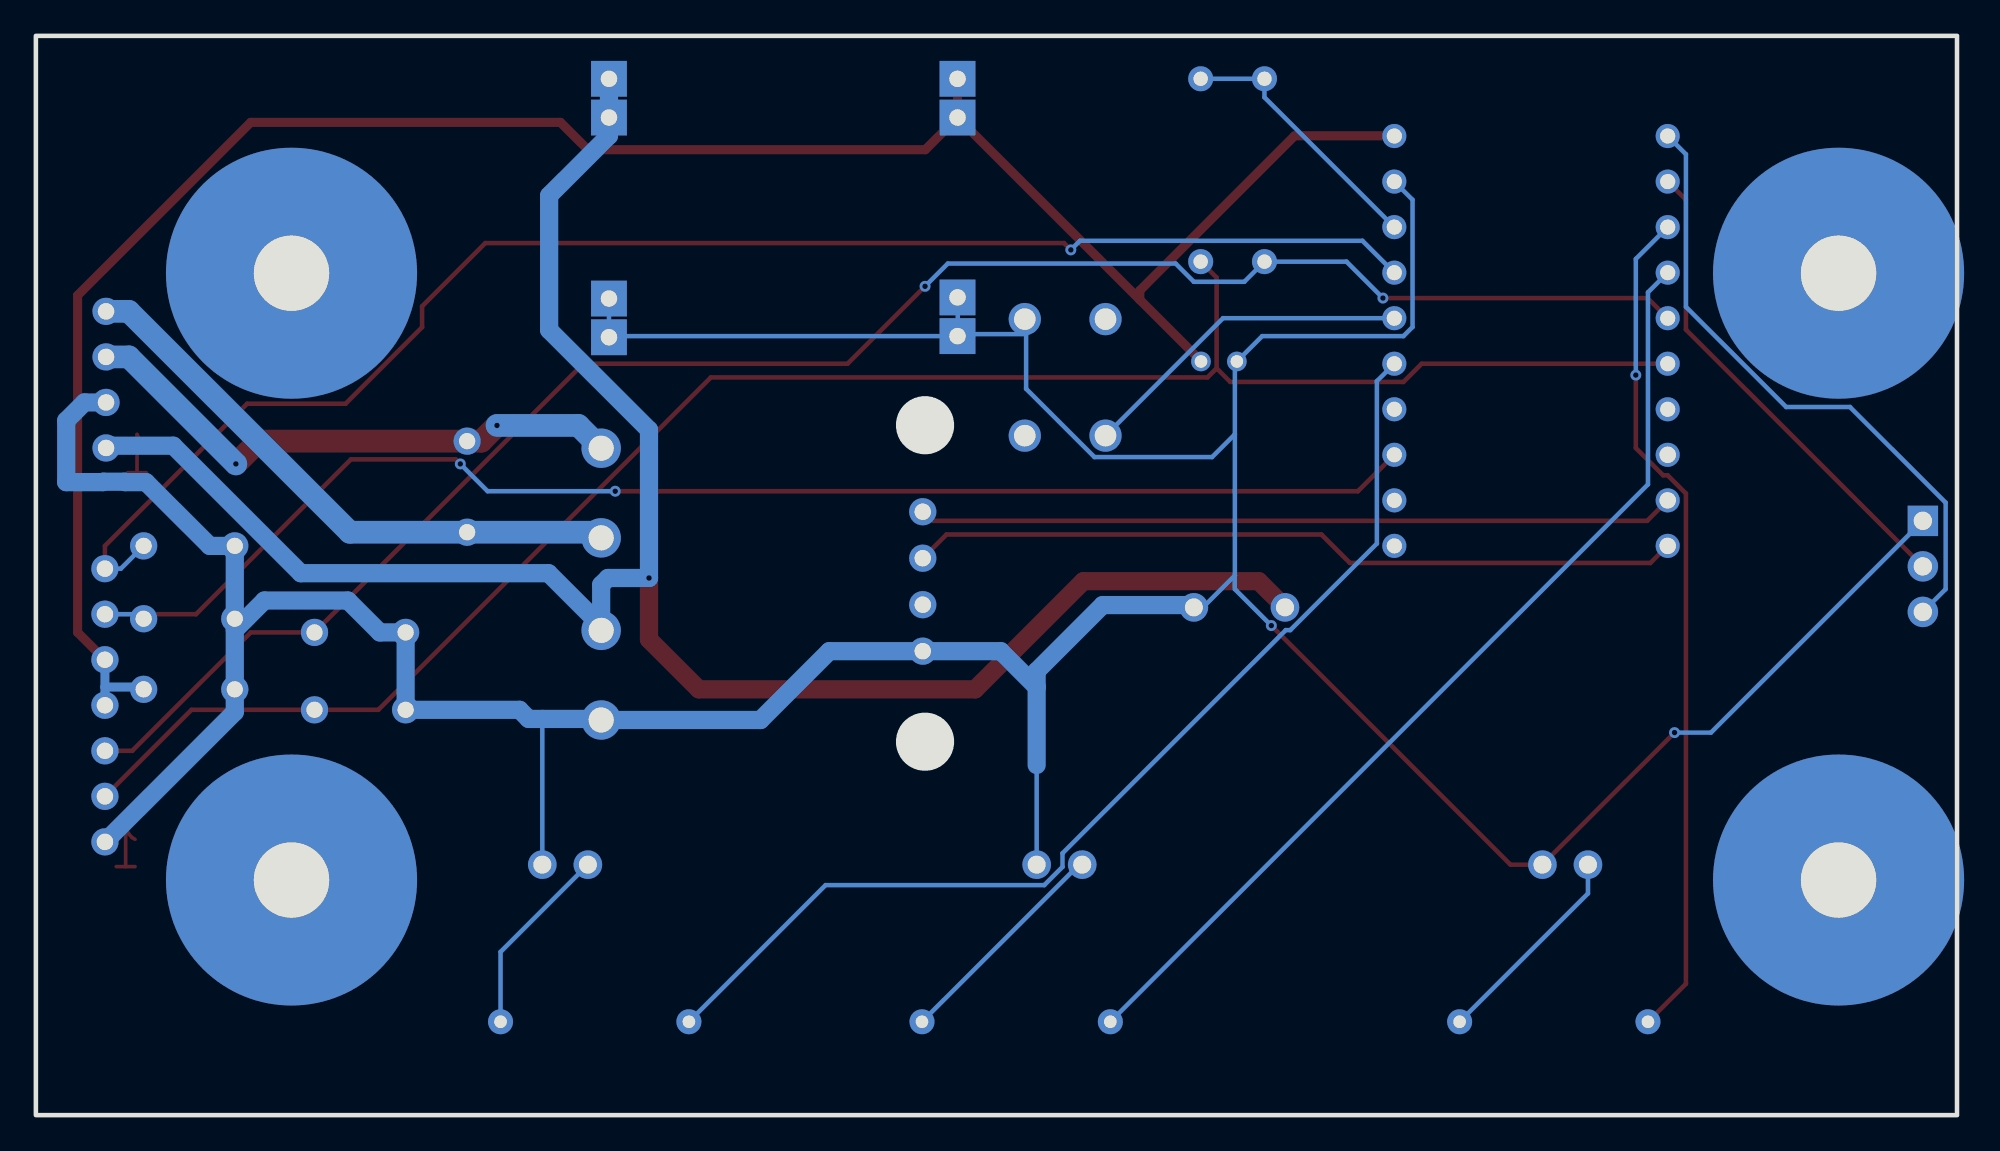
[diagram p5: board, bottom side, seen from below]

Outline 107.1 x 60.2 mm; copper layers: Top Layer, Bottom Layer. Coordinates in mm from the lower left corner of the outline.
Outline path: rectangle 0,60.2 107.1,0
Stack: Top Layer 0.035mm / Dielectric1 1.51mm FR4 er 4.5 / Bottom Layer 0.035mm

## Design rules (mm)
template: Custom Config
spacing copperThickness1oz (default): track to track 0.102, other pairs 0.152 to 0.3
spacing copperThickness2oz: track to track 0.203, other pairs 0.152 to 0.3
track width copperThickness1oz (default): min 0.127, default 0.254, max 2.54
track width copperThickness2oz: min 0.203, default 0.254, max 2.54
track width 20mil: min 0.508, default 0.508, max 1.524
track width motor: min 1.016, default 1.27, max 1.524
differential pair differentialPair (default): width min 0.127, default 0.254, max 2.54; gap min 0.152, default 0.152
via viaSize (default): diameter min 0.5, default 0.61, max 10; hole min 0.3, default 0.305, max 6.3
net +5V uses 20mil
net +12V uses 20mil
net MOTOR1 uses motor
net MOTOR2 uses motor

## Placement (name value [footprint] x y rotation side)
C3  470uF  [CAP-TH_BD10.0-P5.00-D1.0-FD]  40 28.32 0 top
C4  100nF  [CAP-TH_L4.5-W3.5-P5.08-D0.5]  83.06 35.05 90 top
C5  100uF  [CAP-TH_BD5.0-P2.00-D0.5-FD-1]  41.15 42.04 0 top
C6  100nF  [CAP-TH_L4.5-W3.5-P5.08-D0.5]  89.03 22.61 0 top
C7  100nF  [CAP-TH_L4.5-W3.5-P5.08-D0.5]  89.03 26.93 0 top
C8  100nF  [CAP-TH_L4.5-W3.5-P5.08-D0.5]  98.55 23.75 0 top
C9  100nF  [CAP-TH_L4.5-W3.5-P5.08-D0.5]  98.55 27.69 0 top
C10  100nF  [CAP-TH_L4.5-W3.5-P5.08-D0.5]  98.55 31.75 0 top
CN2  2510-7A平弯  [CONN-TH_7P-P2.54_KF2510-7AW]  103.25 22.86 270 top
CN3  2510-4A平弯  [CONN-TH_4P-P2.54_KF2510-4AGW]  103.19 41.02 270 top
H3  PZ254V-11-03P  [HDR-TH_3P-P2.54-V-M_PZ254V-11-03P]  1.91 30.61 270 top
LED1  333-2SYGD/S530-E2-L  [LED-TH_BD5.0-P2.54-FD]  21.84 13.97 0 top
LED2  333-2UYD/S530-A3-L  [LED-TH_BD5.0-P2.54-FD]  50.04 13.97 0 top
LED3  333-2UYD/S530-A3-L  [LED-TH_BD5.0-P2.54-FD]  77.6 13.97 0 top
M1  -  [Adafruit DRV8871]  49.15 8.13 0 top
NOREF  -  [Pad_e5]  92.85 13.11 0 top
NOREF#2  -  [Pad_e7]  6.6 46.96 0 top
NOREF#3  -  [Pad_e6]  6.6 13.11 0 top
NOREF#4  -  [Pad_e3]  92.85 46.96 0 top
R2  220Ω  [RES-TH_BD2.3-L6.5-P10.50-D0.5]  22.48 5.21 0 top
R3  220Ω  [RES-TH_BD2.3-L6.5-P10.50-D0.5]  52.45 5.21 0 top
R4  220Ω  [RES-TH_BD2.3-L6.5-P10.50-D0.5]  75.95 5.21 0 top
R5  10kΩ  [RES-TH_BD2.7-L6.2-P10.20-D0.4]  38.61 52.71 90 top
R6  10kΩ  [RES-TH_BD2.7-L6.2-P10.20-D0.4]  42.16 52.71 90 top
SW1  LXW-TS-6X6X5-DIP  [SW-TH_4P-L6.0-W6.0-P4.50-LS6.5]  49.72 41.15 90 top
U5  -  [Buck Converter]  77.6 17.65 0 top
U6  ESP32-C6 SuperMini  [COMM-TH_ESP32-C6-SUPERMINI]  23.75 45.72 0 top

## Footprints (pads in the part's own frame, mm; a bottom-side part is the same pattern mirrored in y, then rotated)
Adafruit DRV8871
  round 1.524 hole 0.914: 1(8.509,25.527) 2(8.509,22.934) 3(8.509,20.341) 4(8.509,17.749)
  round 2.2 hole 1.4: 5(26.438,24.07) 6(26.438,29.07) 7(26.438,18.91) 8(26.438,13.91)
Buck Converter
  rect 2x2 hole 0.914: 1(-2.446,27.893) 1(-2.446,25.734) 2(-2.446,40.148) 2(-2.446,37.989) 3(-21.877,27.956) 3(-21.877,25.797) 4(-21.877,40.148) 4(-21.877,37.989)
CAP-TH_BD5.0-P2.00-D0.5-FD-1
  round 1.1 hole 0.7: 1(-1,0) 2(1,0)
CAP-TH_BD10.0-P5.00-D1.0-FD
  round 1.6 hole 1: 1(-2.54,0) 2(2.54,0)
CAP-TH_L4.5-W3.5-P5.08-D0.5
  round 1.524 hole 0.9: 1(-2.54,0) 2(2.54,0)
COMM-TH_ESP32-C6-SUPERMINI
  round 1.348 hole 0.841x0.84: 1(-7.62,8.89) 2(-7.62,6.35) 3(-7.62,3.81) 4(-7.62,1.27) 5(-7.62,-1.27) 6(-7.62,-3.81) 7(-7.62,-6.35) 13(7.62,-8.89) 14(7.62,-6.35) 15(7.62,-3.81) 16(7.62,-1.27) 17(7.62,1.27) 18(7.62,3.81) 19(7.62,6.35) 20(7.62,8.89)
  round 1.349 hole 0.914x0.841: 8(-7.62,-8.89) 9(-7.62,-11.431) 10(-7.62,-13.97)
  round 1.349 hole 0.841: 11(7.62,-13.97) 12(7.62,-11.431)
CONN-TH_4P-P2.54_KF2510-4AGW
  round 1.524 hole 0.914: 1(3.81,0) 2(1.27,0) 3(-1.27,0) 4(-3.81,0)
CONN-TH_7P-P2.54_KF2510-7AW
  round 1.524 hole 0.914: 1(7.62,0) 2(5.08,0) 3(2.54,0) 4(0,0) 5(-2.54,0) 6(-5.08,0) 7(-7.62,0)
HDR-TH_3P-P2.54-V-M_PZ254V-11-03P
  rect 1.7x1.7 hole 1.02: 1(-2.54,0)
  round 1.7 hole 1.02: 2(0,0) 3(2.54,0)
LED-TH_BD5.0-P2.54-FD
  round 1.6 hole 1: 1(-1.27,0) 2(1.27,0)
Pad_e3
  round 14 hole 4.2: 1(0,0)
Pad_e5
  round 14 hole 4.2: 1(0,0)
Pad_e6
  round 14 hole 4.2: 1(0,0)
Pad_e7
  round 14 hole 4.2: 1(0,0)
RES-TH_BD2.3-L6.5-P10.50-D0.5
  round 1.4 hole 0.7: 1(-5.25,0) 2(5.25,0)
RES-TH_BD2.7-L6.2-P10.20-D0.4
  round 1.4 hole 0.8: 1(-5.1,0) 2(5.1,0)
SW-TH_4P-L6.0-W6.0-P4.50-LS6.5
  round 1.8 hole 1.2: 1(-3.25,2.25) 2(3.25,2.25) 3(-3.25,-2.25) 4(3.25,-2.25)

## Nets
+3.3V: R5.2 R6.2 U6.18
+5V: C5.2 C8.2 CN2.4 CN2.5 U5.4 U6.20
+12V: C3.1 CN3.1 M1.7 U5.2
GND: C3.2 C5.1 C6.1 C7.1 C8.1 C9.1 C10.1 CN2.1 CN3.2 H3.1 LED1.2 LED2.2 LED3.2 M1.4 M1.8 SW1.4 U5.1 U5.3 U6.19
ANTI_PINCH: C10.2 CN2.7 U6.17
BTN: SW1.1 U6.16
HALL_DUMP: C6.2 CN2.2 R6.1 U6.6
HALL_HOME: C7.2 CN2.3 R5.1 U6.5
IN1: M1.1 U6.9
IN2: M1.2 U6.10
LED-GREEN: R2.1 U6.3
LED-RED: R4.1 U6.15
LED-YELLOW: R3.1 U6.4
MOTOR1: C4.2 CN3.3 M1.6
MOTOR2: C4.1 CN3.4 M1.5
WEIGHT_SW: C9.2 CN2.6 U6.13
$1N1818: LED1.1 R2.2
$1N1822: LED2.1 R3.2
$1N7655: H3.3 U6.1
$1N7691: H3.2 U6.2
$1N8896: LED3.1 R4.2

Pads without a net: M1 3; NOREF 1; NOREF#2 1; NOREF#3 1; NOREF#4 1; SW1 2 3; U6 7 8 11 12 14

## Via types
v1: diameter 0.61, hole 0.305, Top Layer to Bottom Layer, 11 vias

## Routing (per net, layer and track width the routed paths; a pad name or vN(x,y) marks a point on that pad's centre or on a via; arc(x,y) is an arc through that point)
+3.3V: length 14.8
  Bottom Layer w0.254: U6.18 38.61,56.77 38.61,57.81 42.16,57.81
+5V: length 119.8
  Top Layer w0.508: U5.4 57.51,53.85 76.33,53.85 77.85,55.37 95.12,55.37 104.78,45.72 104.78,26.93 CN2.5 ; U5.4 45.56,45.48 ; U5.4 U5.4 ; 45.56,45.48 42.15,42.07 C5.2 ; 45.56,45.48 45.56,45.99 36.92,54.63 31.39,54.63 U6.20
  Bottom Layer w0.508: CN2.5 103.25,23.88 ; 103.25,23.88 101.22,23.88 C8.2 ; 103.25,23.88 CN2.4
+12V: length 111.8
  Top Layer w1.016: C3.1 38.93,29.78 48.71,29.78 54.74,23.75 70.14,23.75 72.92,26.53 v1(72.92,29.96)
  Bottom Layer w1.016: 75.59,27.29 75.59,29.58 75.21,29.96 v1(72.92,29.96) 72.92,38.22 78.49,43.79 78.49,51.29 75.15,54.63 U5.2 U5.2 ; 75.59,27.29 M1.7 ; 75.59,27.29 78.52,30.23 92.33,30.23 99.44,37.34 103.06,37.34 CN3.1
GND: length 251.5
  Top Layer w0.254: v1(38.23,27.31) 24.89,13.97 LED1.2 v1(15.75,21.34)
  Bottom Layer w0.254: LED2.2 51.31,19.53 ; 40.26,30.1 42.04,28.32 C3.2 ; 40.26,30.1 40.26,37.97 ; 40.26,30.1 40.26,29.34 v1(38.23,27.31) ; 40.26,37.97 40.26,41.93 C5.1 38.74,43.45 30.86,43.45 30.35,43.96 30.35,51.06 U6.19 ; 40.26,37.97 41.53,36.7 48.09,36.7 51.9,40.51 51.9,43.56 ; 78.87,22.1 78.87,13.97 ; 55.71,43.56 55.71,43.47 U5.3 75.09,43.45 U5.1 U5.1 ; 55.71,43.56 51.9,43.56 ; 55.71,43.56 55.71,45.6 U5.3 ; H3.1 13.72,21.34 v1(15.75,21.34) ; 51.9,43.56 51.9,44.32 SW1.4 ; 96.01,27.05 C9.1
  Bottom Layer w1.016: CN2.1 96.01,22.48 C8.1 96.01,27.05 94.36,28.7 89.7,28.7 87.92,26.93 C7.1 C6.1 80.14,22.61 79.63,22.1 75.65,22.1 M1.8 66.7,22.04 62.87,25.88 53.31,25.88 51.31,23.88 ; 51.31,23.88 51.31,24.77 47.62,28.45 42.67,28.45 C3.2 ; 51.31,23.88 51.31,19.53 ; C9.1 96.01,31.5 96.27,31.75 97.41,31.75 100.97,35.31 102.13,35.31 102.15,35.33 103.33,35.33 103.36,35.31 105.41,35.31 105.41,38.74 104.39,39.75 CN3.2
ANTI_PINCH: length 84.6
  Top Layer w0.254: CN2.7 103.25,31.75 95.32,39.68 89.83,39.68 85.57,43.95 85.57,45.11 82.04,48.64 49.78,48.64 v1(49.4,48.26)
  Bottom Layer w0.254: C10.2 102.36,30.48 CN2.7 ; U6.17 33.15,48.77 48.9,48.77 v1(49.4,48.26)
BTN: length 18.8
  Bottom Layer w0.254: SW1.1 40.92,44.45 U6.16
HALL_DUMP: length 104.1
  Top Layer w0.254: R6.1 41.28,46.72 41.28,41.66 ; 16.13,41.91 29.84,41.91 30.86,40.9 40.51,40.9 41.28,41.66 ; 41.28,41.66 41.78,41.15 69.47,41.15 88.01,22.61 C6.2 98.43,22.61 CN2.2
HALL_HOME: length 100.6
  Top Layer w0.254: v1(57.53,46.23) 61.85,41.91 76.58,41.91 C7.2 95.12,26.93 101.73,20.32 CN2.3 ; v1(32,45.57) 17.25,45.57 16.13,44.45
  Bottom Layer w0.254: v1(32,45.57) 34.04,47.61 R5.1 39.73,46.48 42.54,46.48 43.56,47.5 56.26,47.5 v1(57.53,46.23)
IN1: length 42.2
  Top Layer w0.254: M1.1 57.15,33.15 17.27,33.15 16.13,34.29
IN2: length 43.1
  Top Layer w0.254: M1.2 56.34,32.39 35.43,32.39 33.84,30.8 17.09,30.8 16.14,31.75 16.13,31.75
LED-GREEN: length 47.2
  Top Layer w0.254: v1(17.91,41.28) 17.91,37.21 16.38,35.69 16.13,35.69 15.11,34.67 15.11,7.32 R2.1
  Bottom Layer w0.254: v1(17.91,41.28) 17.91,47.75 16.13,49.53
LED-RED: length 60.3
  Bottom Layer w0.254: U6.15 32.34,40.94 32.34,31.88 37.17,27.05 37.42,27.05 49.87,14.61 49.87,13.84 50.88,12.83 63.08,12.83 R4.1
LED-YELLOW: length 54.7
  Bottom Layer w0.254: R3.1 17.23,35.18 17.23,45.89 16.13,46.99
MOTOR1: length 31.5
  Top Layer w1.27: v1(95.95,36.32) 94.68,37.59 C4.2 82.27,37.59 v1(81.39,38.47)
  Bottom Layer w1.27: M1.6 76.86,38.47 v1(81.39,38.47) ; CN3.3 101.92,42.29 v1(95.95,36.32)
MOTOR2: length 32.8
  Bottom Layer w1.27: CN3.4 101.92,44.83 89.6,32.51 C4.1 75.9,32.51 M1.5
WEIGHT_SW: length 79.3
  Top Layer w0.254: v1(74.8,34.8) 33.4,34.8 U6.13 ; v1(83.44,36.32) 83.69,36.58 89.53,36.58 98.17,27.94 CN2.6
  Bottom Layer w0.254: CN2.6 101.35,27.94 C9.2 ; v1(83.44,36.32) 81.91,34.8 v1(74.8,34.8)
$1N1818: length 11.7
  Bottom Layer w0.254: R2.2 20.57,12.36 LED1.1
$1N1822: length 12.6
  Bottom Layer w0.254: R3.2 48.94,13.97 LED2.1
$1N7655: length 35.6
  Bottom Layer w0.254: H3.3 0.64,29.34 0.64,34.16 5.97,39.5 9.53,39.5 15.11,45.09 15.11,53.6 16.13,54.61
$1N7691: length 27.4
  Top Layer w0.254: 16.13,52.07 15.11,51.06 15.11,43.82 H3.2
$1N8896: length 10.8
  Bottom Layer w0.254: R4.2 81.2,9.1 LED3.1

## Text on the board
Top Layer: 1
Top Silkscreen Layer: LR2Redux v2 / CCEMG Engineering
